# Altium schematic sheet CTR_Precharge.SchDoc: Precharge
size A4; DrawnBy: Andrei Divinagracia; Revision: 0A; SheetNumber: 10; SheetTotal: 10
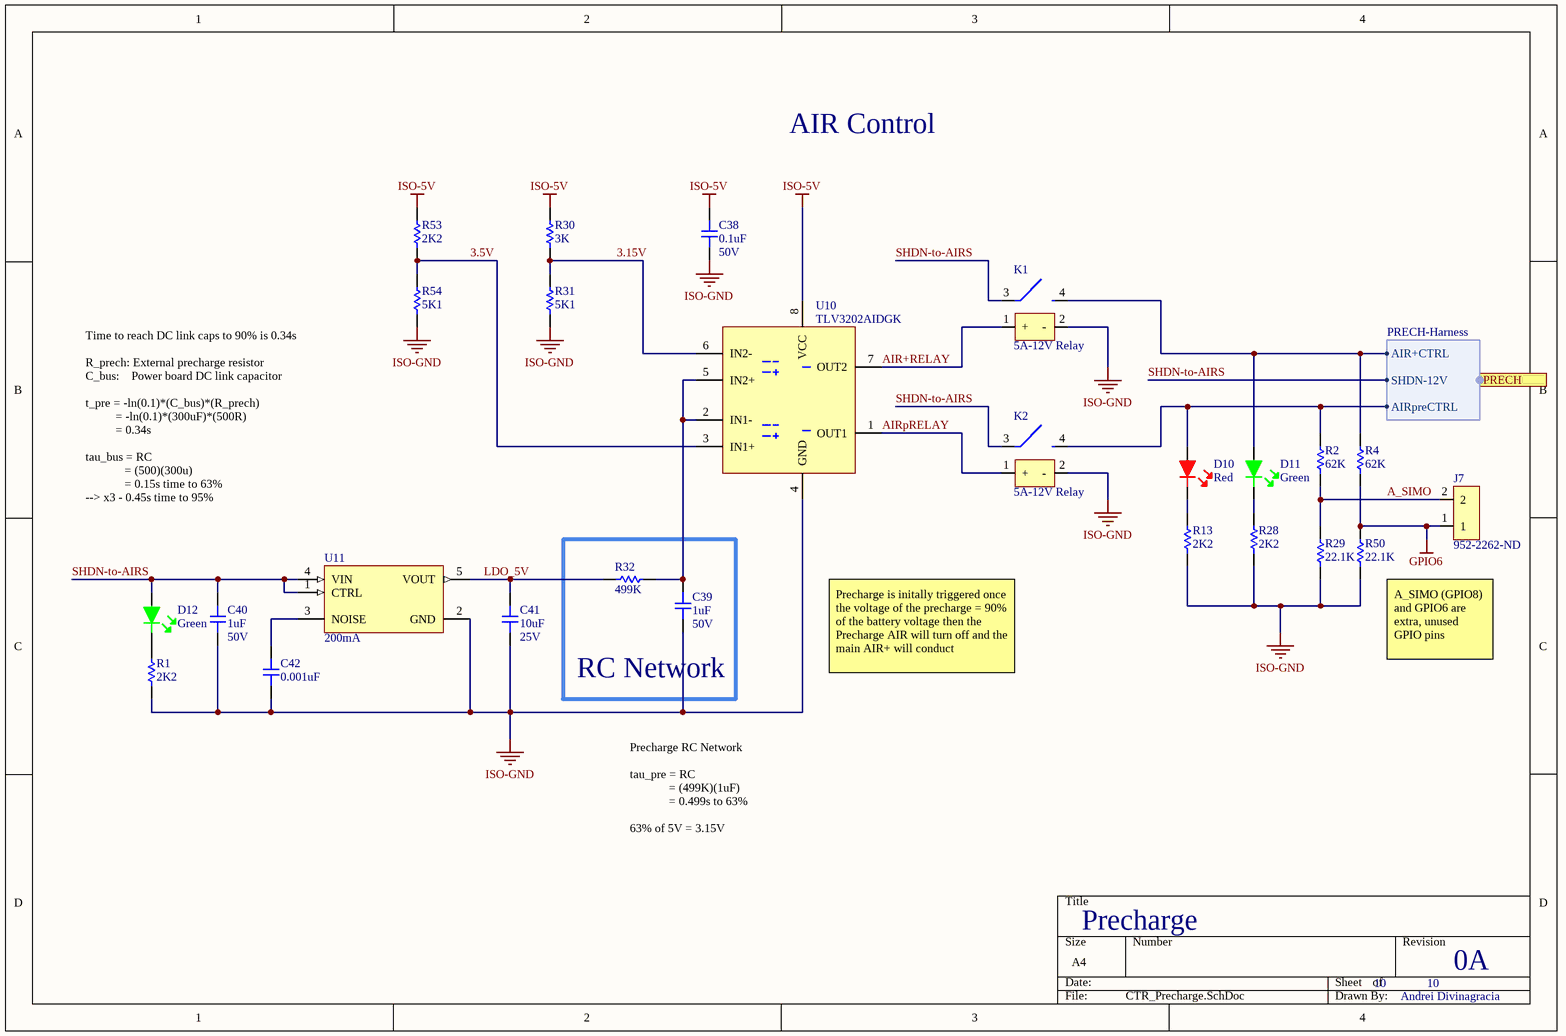
[diagram p0: CTR_Precharge.SchDoc]

## Parts
C38  0.1uF  Voltage Rating: 50V  [CAP-0805]
C39  1uF  Voltage Rating: 50V  [CAP-0805]
C40  1uF  Voltage Rating: 50V  [CAP-0805]
C41  10uF  Voltage Rating: 25V  [CAP-1206]
C42  0.001uF  [CAP-0603]
D10  Red  [LED-0603]
D11  Green  [LED-0603]
D12  Green  [LED-0603]
J7  952-2262-ND  [2PIN_HEADER]
K1  5A-12V Relay  [Relay]
K2  5A-12V Relay  [Relay]
R1  2K2  [RES-0603]
R2  62K  [RES-0603]
R4  62K  [RES-0603]
R13  2K2  [RES-0603]
R28  2K2  [RES-0603]
R29  22.1K  [RES-0603]
R30  3K  [RES-0603]
R31  5K1  [RES-0603]
R32  499K  [RES-0603]
R50  22.1K  [RES-0603]
R53  2K2  [RES-0603]
R54  5K1  [RES-0603]
U10  TLV3202AIDGK  [8VSSOP]
U11  200mA  [SOT-753-ldo]

## Blocks framed on the sheet
RC Network: C39 R32

## Ports
PRECH (harness PRECH-Harness)

## Harnesses
PRECH-Harness: AIRpreCTRL, AIR+CTRL, SHDN-12V

## Nets
GPIO6: J7.1 R4.1 R50.2
ISO-5V: C38.2 R30.2 R53.2 U10.8(VCC)
ISO-GND: C38.1 C39.1 C40.1 C41.1 C42.2 K1.2(-) K2.2(-) R1.1 R13.1 R28.1 R29.1 R31.1 R50.1 R54.1 U10.4(GND) U11.2(GND)
3.5V: R53.1 R54.2 U10.3(IN1+)
3.15V: R30.1 R31.2 U10.6(IN2-)
A_SIMO: J7.2 R2.1 R29.2
AIR+RELAY: K1.1(+) U10.7(OUT2)
AIRpRELAY: K2.1(+) U10.1(OUT1)
LDO_5V: C41.2 R32.1 U11.5(VOUT)
SHDN-to-AIRS: C40.2 D12.1 K1.3 K2.3 U11.1(CTRL) U11.4(VIN) ; port PRECH.SHDN-12V
NetC39_2: C39.2 R32.2 U10.2(IN1-) U10.5(IN2+)
NetC42_1: C42.1 U11.3(NOISE)
NetD10_1: D10.1 K2.4 R2.2 ; port PRECH.AIRpreCTRL
NetD10_2: D10.2 R13.2
NetD11_1: D11.1 K1.4 R4.2 ; port PRECH.AIR+CTRL
NetD11_2: D11.2 R28.2
NetD12_2: D12.2 R1.2

## Notes on the sheet
- AIR Control
- Time to reach DC link caps to 90% is 0.34s
  R_prech: External precharge resistor
  C_bus:    Power board DC link capacitor
  t_pre = -ln(0.1)*(C_bus)*(R_prech)
  = -ln(0.1)*(300uF)*(500R)
  = 0.34s
  tau_bus = RC
  = (500)(300u)
  = 0.15s time to 63%
  --> x3 - 0.45s time to 95%
- (near R50) A_SIMO (GPIO8) and GPIO6 are extra, unused GPIO pins
- Precharge is initally triggered once the voltage of the precharge = 90% of the battery voltage then the Precharge AIR will turn off and the main AIR+ will conduct
- Precharge RC Network
  tau_pre = RC
  = (499K)(1uF)
  = 0.499s to 63%
  63% of 5V = 3.15V

## Library data of the parts
C38 = 0805-0.1uF-50V: CAP CER 0.1UF 50V Y5V 0805; Manufacturer: KEMET; Manufacturer Part Number: C0805C104Z5VACTU; Dielectric Material: Ceramic; Tolerance: 80%; Dissipation Factor: 5%; Capacitance: 100nF; Supplier 1: Digi-Key; Stock 1: 929243; Pricing 1: 1=0.1, 10=0.057, 100=0.0254, 500=0.01818, 1000=0.01428 (USD); Mount: Surface Mount,PCB; Case/Package: 0805; Number of Pins: 2; Case Code (Metric): 2012; Case Code (Imperial): 0805; Min Operating Temperature: -30°C; Max Operating Temperature: 85°C; Package Quantity: 1; Packaging: Tape and Reel; Voltage Rating (DC): 50V; Dielectric: Y5V; Termination: SMD/SMT; Voltage: 50V; Length: 2mm; Height: 0.9mm; Lead Pitch: 0.75mm; Width: 0.049inch; Thickness: 0.039inch; Depth: 1.25mm; Radiation Hardening: No; REACH SVHC: No SVHC; Lead Free: Lead Free; ComponentLink1URL: http://www.alliedelec.com/m/d/9bfe7773041ffe9d406e68bc7b377fdd.pdf?src-supplier=Allied+Electronics; ComponentLink1Description: http://www.alliedelec.com/m/d/9bfe7773041ffe9d406e68bc7b377fdd.pdf?src-supplier=Allied+Electronics; ComponentLink2URL: https://www.verical.com/server-webapp/html/getDatasheet?partID=37101&src-supplier=Verical; ComponentLink2Description: https://www.verical.com/server-webapp/html/getDatasheet?partID=37101&src-supplier=Verical; ComponentLink3URL: https://www.verical.com/server-webapp/html/getDatasheet?partID=321176&src-supplier=Verical; ComponentLink3Description: https://www.verical.com/server-webapp/html/getDatasheet?partID=321176&src-supplier=Verical; ComponentLink4URL: http://www.farnell.com/datasheets/2123124.pdf?src-supplier=Element14; ComponentLink4Description: http://www.farnell.com/datasheets/2123124.pdf?src-supplier=Element14; Supplier Part Number 1: 399-1177-6-ND
C39 C40 = 0805-1uF-50V: CAP CER 1UF 50V X5R 0805; Manufacturer: KEMET; Manufacturer Part Number: C0805C105K5PACTU; Dielectric Material: Ceramic; Tolerance: 10%; Supplier 1: Digi-Key; Stock 1: 7193; Pricing 1: 1=0.33, 10=0.23, 100=0.1378, 500=0.10334, 1000=0.08726 (USD); Mount: Surface Mount; Case/Package: 0805; Weight: 0.000194oz; Case Code (Metric): 2012; Case Code (Imperial): 0805; Min Operating Temperature: -55°C; Max Operating Temperature: 85°C; Dielectric: X5R; Packaging: Tape and Reel; Termination: SMD/SMT; Voltage Rating (DC): 50V; Package Quantity: 2500; Length: 0.079inch; Width: 0.049inch; Thickness: 0.055inch; REACH SVHC: No SVHC; Lead Free: Lead Free; ComponentLink1URL: https://api.kemet.com/component-edge/download/datasheet/C0805C105K5PAC7800.pdf?src-supplier=Digi-Key; ComponentLink1Description: https://api.kemet.com/component-edge/download/datasheet/C0805C105K5PAC7800.pdf?src-supplier=Digi-Key; ComponentLink2URL: http://www.farnell.com/datasheets/2746140.pdf?src-supplier=Farnell; ComponentLink2Description: http://www.farnell.com/datasheets/2746140.pdf?src-supplier=Farnell; ComponentLink3URL: http://www.mouser.com/ds/2/212/KEM_C1006_X5R_SMD-1103249.pdf?src-supplier=Mouser; ComponentLink3Description: http://www.mouser.com/ds/2/212/KEM_C1006_X5R_SMD-1103249.pdf?src-supplier=Mouser; ComponentLink4URL: http://www.farnell.com/datasheets/2746140.pdf?src-supplier=Newark; ComponentLink4Description: http://www.farnell.com/datasheets/2746140.pdf?src-supplier=Newark; ComponentLink5URL: http://www.farnell.com/datasheets/2032728.pdf?src-supplier=Element14; ComponentLink5Description: http://www.farnell.com/datasheets/2032728.pdf?src-supplier=Element14; Supplier Part Number 1: 399-15436-6-ND; Capacitance: 1uF
C41 = 1206-10uF-25V: CAP CER 10UF 25V X7R 1206; Manufacturer: Samsung; Manufacturer Part Number: CL31B106KAHZW6E; Tolerance: 10%; Supplier 1: Digi-Key; Stock 1: 9279; Pricing 1: 1=0.37, 10=0.255, 50=0.1786, 100=0.153, 500=0.11478, 1000=0.09693 (USD); Mount: Surface Mount; Case/Package: 1206; Case Code (Imperial): 1206; Case Code (Metric): 3216; Min Operating Temperature: -55°C; Max Operating Temperature: 125°C; Features: Soft Termination; Packaging: Cut Tape; Capacitance: 10uF; RoHS Compliant: Yes; ComponentLink1URL: http://www.samsungsem.com/kr/support/product-search/mlcc/CL31B106KAHZW6E.jsp?src-supplier=Digi-Key; ComponentLink1Description: http://www.samsungsem.com/kr/support/product-search/mlcc/CL31B106KAHZW6E.jsp?src-supplier=Digi-Key; Supplier Part Number 1: 1276-7031-1-ND
C42 = 0603-10nF: CAP CER 10000PF 50V X7R 0603; Manufacturer: Kyocera AVX; Manufacturer Part Number: 06035C103KAT4A; Tolerance: 10%; Capacitance: 10nF; Dissipation Factor: 2.5%; Insulation Resistance: 100GR; Supplier 1: Digi-Key; Stock 1: 265526; Pricing 1: 1=0.1, 10=0.035, 50=0.019, 100=0.0155, 500=0.01106, 1000=0.0087, 2500=0.00791, 5000=0.00727 (USD); Mount: Surface Mount; Case/Package: 0603; Number of Pins: 2; Case Code (Imperial): 0603; Case Code (Metric): 1608; Min Operating Temperature: -55°C; Max Operating Temperature: 125°C; Package Quantity: 15000; Voltage Rating: 50V; Voltage Rating (DC): 50V; Packaging: Tape and Reel; Dielectric: X7R; Termination: SMD/SMT; Voltage: 50V; Series: -; Construction: Flat; Length: 1.6mm; Width: 0.81mm; Height: 0.9mm; Depth: 0.81mm; Radiation Hardening: No; REACH SVHC: No SVHC; Lead Free: Lead Free; RoHS Compliant: Yes; ComponentLink1URL: http://www.avx.com/docs/catalogs/cx7r.pdf?src-supplier=Avnet; ComponentLink1Description: http://www.avx.com/docs/catalogs/cx7r.pdf?src-supplier=Avnet; ComponentLink2URL: http://datasheets.avx.com/X7RDielectric.pdf?src-supplier=Future+Electronics; ComponentLink2Description: http://datasheets.avx.com/X7RDielectric.pdf?src-supplier=Future+Electronics; ComponentLink3URL: http://www.farnell.com/datasheets/2237835.pdf?src-supplier=Element14; ComponentLink3Description: http://www.farnell.com/datasheets/2237835.pdf?src-supplier=Element14; Supplier Part Number 1: 478-10055-1-ND
D10 = LED-Red: LED RED CLEAR 0603 SMD; Manufacturer: Wurth Electronics; Manufacturer Part Number: 150060RS75000; Viewing Angle: 140°; Lens Style: Clear,Rectangular; Luminous Intensity: 250mcd; Forward Current: 30mA; Forward Voltage: 2V; Wavelength: 625nm; Test Current: 20mA; Supplier 1: Digi-Key; Stock 1: 18518; Pricing 1: 1=0.14, 50=0.133, 100=0.114, 500=0.099 (USD); Mount: Surface Mount; Case/Package: 0603; Color: Red; Case Code (Metric): 1608; Case Code (Imperial): 0603; Min Operating Temperature: -40°C; Max Operating Temperature: 85°C; Package Quantity: 1; Packaging: Cut Tape; Dominant Wavelength: 625nm; Length: 1.6mm; Height: 0.7mm; Width: 0.8mm; REACH SVHC: Unknown; ComponentLink1URL: https://katalog.we-online.de/led/datasheet/150060RS75000.pdf?src-supplier=Digi-Key; ComponentLink1Description: https://katalog.we-online.de/led/datasheet/150060RS75000.pdf?src-supplier=Digi-Key; ComponentLink2URL: http://www.produktinfo.conrad.com/datenblaetter/750000-774999/759428-da-01-en-CHIPLED_0603_W_KL_ROT_150060RS75000.pdf?src-supplier=Conrad; ComponentLink2Description: http://www.produktinfo.conrad.com/datenblaetter/750000-774999/759428-da-01-en-CHIPLED_0603_W_KL_ROT_150060RS75000.pdf?src-supplier=Conrad; Supplier Part Number 1: 732-4978-6-ND
D11 D12 = LED-Green: LED GREEN CLEAR 0603 SMD; Manufacturer: Wurth Electronics; Manufacturer Part Number: 150060VS75000; Luminous Intensity: 40mcd; Viewing Angle: 140°; Forward Voltage: 2V; Wavelength: 570nm; Lens Style: Clear,Rectangular; Forward Current: 30mA; Test Current: 20mA; Supplier 1: Digi-Key; Stock 1: 118118; Pricing 1: 1=0.14, 50=0.133, 100=0.114, 500=0.099 (USD); Mount: Surface Mount; Case/Package: 0603; Number of Pins: 2; Color: Green; Case Code (Metric): 1608; Case Code (Imperial): 0603; Min Operating Temperature: -40°C; Max Operating Temperature: 85°C; Package Quantity: 1; Packaging: Tape and Reel; Dominant Wavelength: 570nm; Length: 1.6mm; Height: 0.7mm; Width: 0.8mm; REACH SVHC: Unknown; ComponentLink1URL: https://katalog.we-online.de/led/datasheet/150060VS75000.pdf?src-supplier=Digi-Key; ComponentLink1Description: https://katalog.we-online.de/led/datasheet/150060VS75000.pdf?src-supplier=Digi-Key; Supplier Part Number 1: 732-4980-1-ND
J7 = M20-9990246: CONN HEADER VERT 2POS 2.54MM; Manufacturer: Harwin; Contact Resistance: 30mR; Max Current Rating: 3A; Number of Positions: 2; Gender: Male; Connector Type: Male Pin; Insulation Resistance: 10GR; Voltage Rating (AC): 750V; Supplier 1: Digi-Key; Manufacturer Part Number: M20-9990246; Stock 1: 53577; Pricing 1: 1=0.11, 10=0.099, 100=0.0609, 500=0.0504, 1000=0.0441, 5000=0.0378, 10000=0.0368 (USD); Case/Package: SIL; Colour: Black; Housing Colour: Black; Housing Material: Nylon; Contact Plating: Tin; Contact Material: Bronze,Brass; Min Operating Temperature: -40°C; Max Operating Temperature: 105°C; Package Quantity: 1000; Packaging: Bulk; Termination: Solder; Number of Rows: 1; Number of Contacts: 2; Orientation: Straight; Current Rating: 3A; Length: 5.08mm; Depth: 2.54mm; Pitch: 2.54mm; Contact Mating Length: 0.24inch; Radiation Hardening: No; REACH SVHC: No SVHC; ComponentLink1URL: https://datasheet.ciiva.com/8046/315376-8046930.pdf; ComponentLink1Description: https://datasheet.ciiva.com/8046/315376-8046930.pdf; ComponentLink2URL: https://datasheet.ciiva.com/6833/m20-999-6833368.pdf; ComponentLink2Description: https://datasheet.ciiva.com/6833/m20-999-6833368.pdf; ComponentLink3URL: https://datasheet.ciiva.com/11745/0900766b81034e61-11745755.pdf; ComponentLink3Description: https://datasheet.ciiva.com/11745/0900766b81034e61-11745755.pdf; ComponentLink4URL: https://datasheet.ciiva.com/22660/1830818-22660571.pdf; ComponentLink4Description: https://datasheet.ciiva.com/22660/1830818-22660571.pdf; ComponentLink5URL: https://datasheet.ciiva.com/26852/getdatasheetpartid-384170-26852203.pdf; ComponentLink5Description: https://datasheet.ciiva.com/26852/getdatasheetpartid-384170-26852203.pdf; Supplier Part Number 1: 952-2262-ND
K1 K2 = OJE-SH-112DM,000: General Purpose Relay SPST-NO (1 Form A) 12VDC Coil Through Hole; Manufacturer: TE Connectivity; Contact Current Rating: 5A; Coil Current: 37.5mA; Throw Configuration: SPST; Operate Time: 10ms; Release Time: 4ms; Coil Power: 500mW; Coil Resistance: 320R; Coil Type: Non-Latching; Coil Voltage (DC): 12V; Contact Voltage Rating (DC): 30V; Max Voltage Rating (AC): 265V; Supplier 1: Digi-Key; Manufacturer Part Number: OJE-SH-112DM,000; Stock 1: 912; Pricing 1: 1=1.18, 10=1.105, 25=0.9824, 50=0.9334, 100=0.8843, 250=0.78608, 500=0.73696, 1000=0.68782, 5000=0.66326 (USD); Mount: Through Hole; Number of Pins: 4; Contact Material: Silver; Weight: 9g; Min Operating Temperature: -30°C; Max Operating Temperature: 85°C; Package Quantity: 100; Packaging: Tray; Termination: PCB; Relay Type: General Purpose; Series: OJE, OEG; Max Voltage Rating (DC): 30V; Length: 0.717inch; Width: 0.4inch; Height: 14.7mm; RoHS Compliant: Yes; REACH SVHC: Unknown; Lead Free: Lead Free; ComponentLink1URL: http://www.farnell.com/datasheets/1846831.pdf?src-supplier=Farnell; ComponentLink1Description: http://www.farnell.com/datasheets/1846831.pdf?src-supplier=Farnell; ComponentLink2URL: http://www.onlinecomponents.com/productFiles/mf-PB/ojojeseries.pdf?src-supplier=Onlinecomponents.com; ComponentLink2Description: http://www.onlinecomponents.com/productFiles/mf-PB/ojojeseries.pdf?src-supplier=Onlinecomponents.com; Supplier Part Number 1: PB875-ND
R1 R13 R28 R53 = 0603-2K2: RES SMD 2.2K OHM 5% 1/10W 0603; Manufacturer: Yageo; Manufacturer Part Number: AC0603JR-072K2L; Resistance: 2.2kR; Power Rating: 100mW; Voltage Rating: 50V; Temperature Coefficient: 100ppm/°C; Supplier 1: Digi-Key; Stock 1: 107229; Pricing 1: 1=0.1, 10=0.024, 100=0.0097, 1000=0.00436, 2500=0.00378 (USD); Case/Package: 0603; Case Code (Imperial): 0603; Case Code (Metric): 1608; Contact Plating: Tin,Matte; Min Operating Temperature: -55°C; Max Operating Temperature: 155°C; Tolerance: 5%; Packaging: Tape and Reel; Resistor Type: Thick Film; Termination: SMD/SMT; Number of Terminations: 2; Max Power Dissipation: 100mW; Features: Moisture Resistant,Automotive AEC-Q200; Series: AC; Length: 0.063inch; Width: 0.8mm; Height: 0.022inch; Radiation Hardening: No; Lead Free: Lead Free; RoHS Compliant: Yes; ComponentLink1URL: http://www.mouser.com/ds/2/447/yageodocoutput-1111992.pdf?src-supplier=Mouser; ComponentLink1Description: http://www.mouser.com/ds/2/447/yageodocoutput-1111992.pdf?src-supplier=Mouser; ComponentLink2URL: http://www.yageo.com/documents/recent/PYu-AC_51_RoHS_L_2_revised.pdf?src-supplier=Avnet+Europe; ComponentLink2Description: http://www.yageo.com/documents/recent/PYu-AC_51_RoHS_L_2_revised.pdf?src-supplier=Avnet+Europe; ComponentLink3URL: http://www.yageo.com/NewPortal/yageodocoutput?fileName=/pdf/R-Chip/PYu-AC_51_RoHS_L_6.pdf&src-supplier=Digi-Key; ComponentLink3Description: http://www.yageo.com/NewPortal/yageodocoutput?fileName=/pdf/R-Chip/PYu-AC_51_RoHS_L_6.pdf&src-supplier=Digi-Key; ComponentLink4URL: https://www.yageo.com/upload/media/product/productsearch/datasheet/rchip/PYu-AC_51_RoHS_L_7.pdf?src-supplier=Digi-Key; ComponentLink4Description: https://www.yageo.com/upload/media/product/productsearch/datasheet/rchip/PYu-AC_51_RoHS_L_7.pdf?src-supplier=Digi-Key; Supplier Part Number 1: YAG3657CT-ND
R2 R4 = 0603-62K: RES SMD 62K OHM 1% 1/4W 0603; Manufacturer: Panasonic; Manufacturer Part Number: ERJ-PA3F6202V; Power Rating: 250mW; Resistance: 62kR; Voltage Rating: 150V; Temperature Coefficient: 100ppm/°C; Supplier 1: Digi-Key; Stock 1: 17832; Pricing 1: 1=0.15, 10=0.13, 100=0.05, 1000=0.02201, 2500=0.01901 (USD); Mount: Surface Mount; Case/Package: 0603; Case Code (Metric): 1608; Case Code (Imperial): 0603; Min Operating Temperature: -55°C; Max Operating Temperature: 155°C; Tolerance: 1%; Resistor Type: Thick Film; Packaging: Cut Tape; Number of Terminations: 2; Termination: Solder; Max Power Dissipation: 250mW; Voltage Rating (DC): 150V; Features: Automotive AEC-Q200; Length: 0.063inch; Width: 0.031inch; Height: 0.018inch; Depth: 0.8mm; REACH SVHC: No SVHC; ComponentLink1URL: http://www.farnell.com/datasheets/2059624.pdf?src-supplier=Farnell; ComponentLink1Description: http://www.farnell.com/datasheets/2059624.pdf?src-supplier=Farnell; ComponentLink2URL: http://www.farnell.com/datasheets/1801181.pdf?src-supplier=Element14; ComponentLink2Description: http://www.farnell.com/datasheets/1801181.pdf?src-supplier=Element14; Supplier Part Number 1: P62KBYCT-ND
R29 R50 = 0603-22.1KR: RES SMD 22.1K OHM 1% 1/10W 0603; Manufacturer: Vishay; Manufacturer Part Number: CRCW060322K1FKEA; Power Rating: 100mW; Voltage Rating: 75V; Temperature Coefficient: 100ppm/°C; Resistance: 22.1kR; Supplier 1: Digi-Key; Stock 1: 2740; Pricing 1: 1=0.1, 10=0.036, 100=0.0145, 1000=0.00652, 2500=0.00566 (USD); Mount: Surface Mount; Case/Package: 0603; Weight: 7.1E-05oz; Case Code (Metric): 1608; Case Code (Imperial): 0603; Contact Plating: Tin; Size Code: 0603; Min Operating Temperature: -55°C; Max Operating Temperature: 155°C; Package Quantity: 10; Tolerance: 1%; Packaging: Tape and Reel; Resistor Type: Thick Film; Number of Terminations: 2; Termination: SMD/SMT; Max Power Dissipation: 100mW; Voltage Rating (DC): 75V; Features: Automotive AEC-Q200; Series: CRCW; Resistance Tolerance: 1%; Construction: Rectangular; Technology: THICK FILM; Length: 1.55mm; Width: 0.033inch; Height: 0.45mm; Depth: 0.85mm; Radiation Hardening: No; REACH SVHC: Unknown; Military Standard: Not; Lead Free: Lead Free; RoHS Compliant: Yes; ComponentLink1URL: http://www.farnell.com/datasheets/2046716.pdf?src-supplier=Element14; ComponentLink1Description: http://www.farnell.com/datasheets/2046716.pdf?src-supplier=Element14; ComponentLink2URL: http://www.vishay.com/docs/20035/dcrcwe3.pdf?src-supplier=Digi-Key; ComponentLink2Description: http://www.vishay.com/docs/20035/dcrcwe3.pdf?src-supplier=Digi-Key; ComponentLink3URL: http://uk.rs-online.com/webdocs/0d98/0900766b80d98afc.pdf?src-supplier=RSComponents; ComponentLink3Description: http://uk.rs-online.com/webdocs/0d98/0900766b80d98afc.pdf?src-supplier=RSComponents; ComponentLink4URL: https://www.alliedelec.com/m/d/0c934d6939ccefa68dbe0b96d821c8cf.pdf?src-supplier=Allied+Electronics; ComponentLink4Description: https://www.alliedelec.com/m/d/0c934d6939ccefa68dbe0b96d821c8cf.pdf?src-supplier=Allied+Electronics; ComponentLink5URL: http://www.vishay.com/docs/20035/dcrcwe3.pdf?src-supplier=Avnet; ComponentLink5Description: http://www.vishay.com/docs/20035/dcrcwe3.pdf?src-supplier=Avnet; ComponentLink6URL: http://www.vishay.com/docs/20035/dcrcwe3.pdf?src-supplier=Future+Electronics; ComponentLink6Description: http://www.vishay.com/docs/20035/dcrcwe3.pdf?src-supplier=Future+Electronics; ComponentLink7URL: http://www.vishay.com/docs/20035/dcrcwe3.pdf?src-supplier=Avnet+Europe; ComponentLink7Description: http://www.vishay.com/docs/20035/dcrcwe3.pdf?src-supplier=Avnet+Europe; Supplier Part Number 1: 541-22.1KHDKR-ND
R30 = 0603-3KR: RES SMD 3K OHM 5% 1/10W 0603; Manufacturer: Yageo; Manufacturer Part Number: RC0603JR-073KL; Resistance: 3kR; Power Rating: 100mW; Voltage Rating: 75V; Temperature Coefficient: 100ppm/°C; Voltage Rating (DC): 50V; Supplier 1: Digi-Key; Stock 1: 239018; Pricing 1: 1=0.1, 10=0.02, 100=0.008, 1000=0.0036, 2500=0.00312 (USD); Case/Package: 0603; Number of Pins: 2; Case Code (Imperial): 0603; Case Code (Metric): 1608; Size Code: 0603; Weight: 7.1E-05oz; Min Operating Temperature: -55°C; Max Operating Temperature: 155°C; Tolerance: 5%; Packaging: Tape and Reel; Package Quantity: 1; Termination: SMD/SMT; Resistor Type: Thick Film; Number of Terminations: 2; Max Power Dissipation: 100mW; Features: Moisture Resistant; Series: RC; Resistance Tolerance: 5%; Construction: Rectangular; Length: 1.6mm; Width: 0.8mm; Height: 0.022inch; Depth: 0.8mm; REACH SVHC: No SVHC; Military Standard: Not; Lead Free: Lead Free; RoHS Compliant: Yes; ComponentLink1URL: http://www.yageo.com/documents/recent/PYu-RC_Group_51_RoHS_L_10.pdf?src-supplier=Digi-Key; ComponentLink1Description: http://www.yageo.com/documents/recent/PYu-RC_Group_51_RoHS_L_10.pdf?src-supplier=Digi-Key; ComponentLink2URL: http://www.yageo.com/documents/recent/PYu-RC_Group_51_RoHS_L_9.pdf?src-supplier=Digi-Key; ComponentLink2Description: http://www.yageo.com/documents/recent/PYu-RC_Group_51_RoHS_L_9.pdf?src-supplier=Digi-Key; Supplier Part Number 1: 311-3.0KGRCT-ND
R31 R54 = 0603-5.1KR: RES SMD 5.1K OHM 1% 1/10W 0603; Manufacturer: TE Connectivity; Manufacturer Part Number: 1623257-1; Resistance: 5.1kR; Power Rating: 125mW; Temperature Coefficient: 100ppm/°C; Mount: Surface Mount; Case/Package: 0805; Min Operating Temperature: -55°C; Max Operating Temperature: 125°C; Packaging: Tape and Reel; Tolerance: 1%; Package Quantity: 5000; Resistor Type: Thick Film; Number of Terminations: 2; Series: CRG, Neohm; Max Power Dissipation: 125mW; Construction: Rectangular; Length: 2mm; Width: 0.049inch; Height: 0.026inch; Depth: 1.25mm; Radiation Hardening: No; RoHS Compliant: Yes; Military Standard: Not; ComponentLink1URL: http://www.te.com/commerce/DocumentDelivery/DDEController?Action=showdoc&DocId=Data+Sheet%7F1773204%7FF%7Fpdf%7FEnglish%7FENG_DS_1773204_F.pdf&src-supplier=Avnet+Europe; ComponentLink1Description: http://www.te.com/commerce/DocumentDelivery/DDEController?Action=showdoc&DocId=Data+Sheet%7F1773204%7FF%7Fpdf%7FEnglish%7FENG_DS_1773204_F.pdf&src-supplier=Avnet+Europe; ComponentLink2URL: http://www.te.com/commerce/DocumentDelivery/DDEController?Action=srchrtrv&DocNm=1773204&DocType=DS&DocLang=English&src-supplier=Digi-Key; ComponentLink2Description: http://www.te.com/commerce/DocumentDelivery/DDEController?Action=srchrtrv&DocNm=1773204&DocType=DS&DocLang=English&src-supplier=Digi-Key; ComponentLink3URL: http://www.onlinecomponents.com/productFiles/mf-AMP/eng_ds_1773204_e.pdf?src-supplier=Onlinecomponents.com; ComponentLink3Description: http://www.onlinecomponents.com/productFiles/mf-AMP/eng_ds_1773204_e.pdf?src-supplier=Onlinecomponents.com; Supplier 1: Digi-Key; Supplier Part Number 1: YAG3621CT-ND
R32 = 0603-499KR: RES 499K OHM 1% 1/10W 0603; Manufacturer: Vishay; Manufacturer Part Number: CRCW0603499KFKEAC; Power Rating: 100mW; Resistance: 499kR; Temperature Coefficient: 100ppm/°C; Supplier 1: Digi-Key; Stock 1: 35351; Pricing 1: 1=0.1, 10=0.036, 100=0.0145, 1000=0.00652, 2500=0.00566 (USD); Mount: Surface Mount; Case/Package: SMD/SMT; Contact Plating: Tin; Min Operating Temperature: -55°C; Max Operating Temperature: 155°C; Tolerance: 1%; Resistor Type: Thick Film; Termination: Wraparound; Length: 1.55mm; Lead Free: Lead Free; RoHS Compliant: Yes; Supplier Part Number 1: 541-5445-1-ND
U10 = Compare-TLV3202AIDGK: IC COMPAR PWR RRI DL PP 8VSSOP; Manufacturer: Texas Instruments; Number of Elements: 2; Propagation Delay: 50ns; Min Supply Voltage: 2.7V; Max Supply Voltage: 5.5V; Common Mode Rejection Ratio: 70dB; Nominal Supply Current: 50uA; Max Supply Current: 40uA; Input Bias Current: 50pA; Input Offset Voltage (Vos): 5mV; Response Time: 0.047us; Hysteresis: 1.2mV; Power Supply Rejection Ratio (PSRR): 85dB; Manufacturer Part Number: TLV3202AIDGK; Stock 1: 6035; Pricing 1: 1=1.77, 10=1.59, 25=1.5, 100=1.2, 250=1.05, 500=1.02, 1000=0.81, 2500=0.78, 5000=0.75 (USD); Mount: Surface Mount; Case/Package: VSSOP; Number of Pins: 8; Min Operating Temperature: -40°C; Max Operating Temperature: 125°C; Packaging: Rail/Tube; Package Quantity: 80; Number of Channels: 2; Max Input Current: 50pA; Quiescent Current: 50uA; Type: General Purpose; Length: 3.1mm; Height: 0.95mm; Width: 3.1mm; Radiation Hardening: No; REACH SVHC: No SVHC; Lead Free: Lead Free; ComponentLink1URL: http://www.ti.com/lit/gpn/tlv3202?src-supplier=Mouser; ComponentLink1Description: http://www.ti.com/lit/gpn/tlv3202?src-supplier=Mouser; ComponentLink2URL: http://www.farnell.com/datasheets/1882110.pdf?src-supplier=Element14; ComponentLink2Description: http://www.farnell.com/datasheets/1882110.pdf?src-supplier=Element14; Supplier Part Number 1: 296-34992-ND; Supplier 1: Digi-Key
U11 = TAR5S50TE85LF: IC REG LINEAR 5V 200MA SMV; Manufacturer: Toshiba; Number of Outputs: 1; Min Input Voltage: 5.2V; Max Input Voltage: 15V; Max Power Dissipation: 380mW; Polarity: Positive; Quiescent Current: 850uA; Output Type: Fixed; Supplier 1: Digi-Key; Manufacturer Part Number: TAR5S50TE85LF; Stock 1: 5950; Pricing 1: 1=0.45, 10=0.386, 25=0.36, 100=0.2879, 250=0.26732, 500=0.2262, 1000=0.17479 (USD); Mount: Surface Mount; Number of Pins: 5; Min Operating Temperature: -40°C; Max Operating Temperature: 85°C; Max Output Current: 200mA; Output Voltage: 5V; Radiation Hardening: No; ComponentLink1URL: http://www.semicon.toshiba.co.jp/info/docget.jsp?type=datasheet&lang=en&pid=TAR5S15&src-supplier=Avnet; ComponentLink1Description: http://www.semicon.toshiba.co.jp/info/docget.jsp?type=datasheet&lang=en&pid=TAR5S15&src-supplier=Avnet; ComponentLink2URL: https://toshiba.semicon-storage.com/info/docget.jsp?did=766&amp;prodName=TAR5S40&src-supplier=Digi-Key; ComponentLink2Description: https://toshiba.semicon-storage.com/info/docget.jsp?did=766&amp;prodName=TAR5S40&src-supplier=Digi-Key; ComponentLink3URL: https://toshiba.semicon-storage.com/info/docget.jsp?did=766&prodName=TAR5S40&src-supplier=Digi-Key; ComponentLink3Description: https://toshiba.semicon-storage.com/info/docget.jsp?did=766&prodName=TAR5S40&src-supplier=Digi-Key; Supplier Part Number 1: TAR5S50TE85LFCT-ND